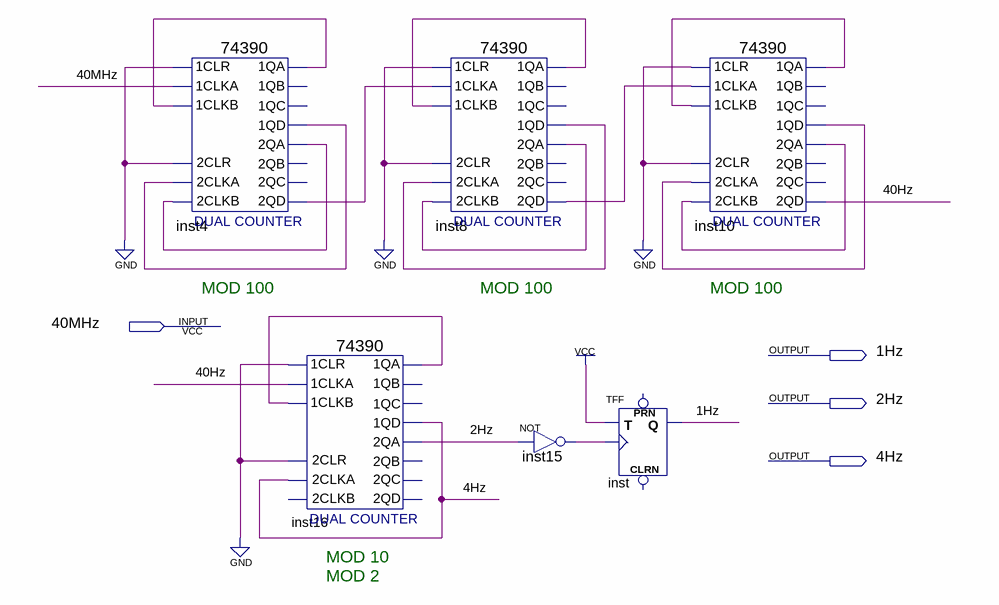
[diagram p0: schematic sheet]
// Quartus schematic 1_2_4Hz.bdf as structural Verilog: 6 symbols, 4 pins
module \1_2_4Hz  (
  input  \40MHz ,
  output \1Hz ,
  output \2Hz ,
  output \4Hz 
);

  wire \40Hz , inst4_1qa, inst4_1qd, inst4_2qa, inst4_2qd, inst8_1qa, inst8_1qd, inst8_2qa, inst8_2qd,
       inst10_1qa, inst10_1qd, inst10_2qa, inst15_out, inst16_1qa;

  \74390  inst4 (
    .\2CLKA (inst4_1qd), .\2CLR (1'b0), .\2CLKB (inst4_2qa), .\1CLR (1'b0), .\1CLKA (\40MHz ),
    .\1CLKB (inst4_1qa), .\1QA (inst4_1qa), .\1QD (inst4_1qd), .\2QA (inst4_2qa), .\2QD (inst4_2qd));  // open: 1QB, 1QC, 2QB, 2QC
  \74390  inst16 (
    .\2CLKA (\4Hz ), .\2CLR (1'b0), .\1CLR (1'b0), .\1CLKA (\40Hz ), .\1CLKB (inst16_1qa),
    .\1QA (inst16_1qa), .\1QD (\4Hz ), .\2QA (\2Hz ));  // open: 2CLKB, 1QB, 1QC, 2QB, 2QC, 2QD
  \74390  inst8 (
    .\2CLKA (inst8_1qd), .\2CLR (1'b0), .\2CLKB (inst8_2qa), .\1CLR (1'b0), .\1CLKA (inst4_2qd),
    .\1CLKB (inst8_1qa), .\1QA (inst8_1qa), .\1QD (inst8_1qd), .\2QA (inst8_2qa), .\2QD (inst8_2qd));  // open: 1QB, 1QC, 2QB, 2QC
  not inst15 (inst15_out, \2Hz );
  TFF inst (.T(1'b1), .CLK(inst15_out), .Q(\1Hz ));  // open: PRN, CLRN
  \74390  inst10 (
    .\2CLKA (inst10_1qd), .\2CLR (1'b0), .\2CLKB (inst10_2qa), .\1CLR (1'b0), .\1CLKA (inst8_2qd),
    .\1CLKB (inst10_1qa), .\1QA (inst10_1qa), .\1QD (inst10_1qd), .\2QA (inst10_2qa), .\2QD (\40Hz ));  // open: 1QB, 1QC, 2QB, 2QC

  // Notes on the sheet:
  //   MOD 100
  //   MOD 100
  //   MOD 100
  //   MOD 10
  //   MOD 2
endmodule
